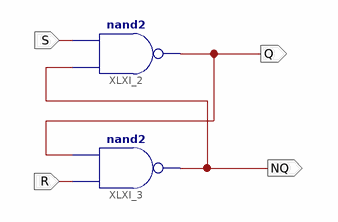
[diagram p0: schematic sheet 1]
// Xilinx ISE schematic latch_RS_NAND.sch (artix7) as structural Verilog: 2 symbols, 4 ports
module latch_RS_NAND (
  input  S,
  input  R,
  output NQ,
  output Q
);

  nand XLXI_2 (Q, NQ, S);
  nand XLXI_3 (NQ, R, Q);
endmodule
